# Altium project LoRa Pager v2.PrjPcb
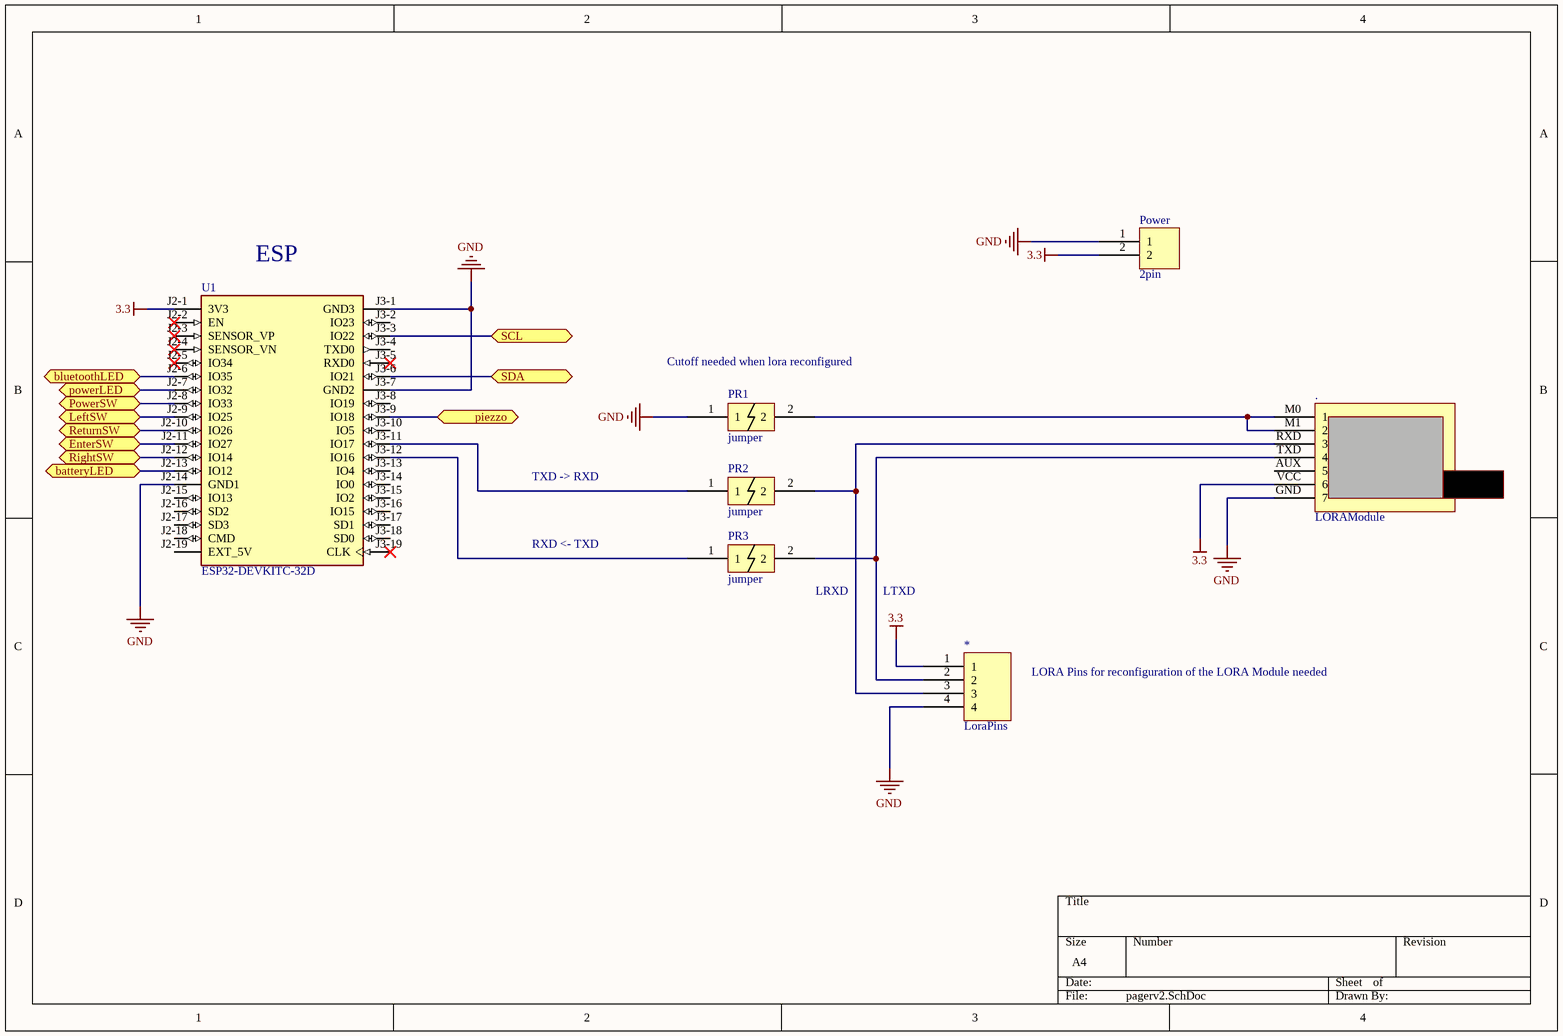
[diagram p0: pagerv2.SchDoc]
2 sheets, 26 parts. Net scope: flat (ports and power ports of the same name join across sheets).
Board file: pagerboardv2.PcbDoc
Sheets:
  pagerv2.SchDoc
  pagerv2IO.SchDoc

## Sheet pagerv2.SchDoc
size A4; SheetNumber: 1; SheetTotal: 2

### Parts
.  LORAModule  [LORAmodule]
LORA_config  LoraPins  [4pin]
Power  2pin  [2PIN]
PR1  jumper  [jumper]
PR2  jumper  [jumper]
PR3  jumper  [jumper]
U1  ESP32-DEVKITC-32D  [MODULE_ESP32-DEVKITC-32D]

### Ports
batteryLED (bidir, see pagerv2IO[2C]), bluetoothLED (bidir, see pagerv2IO[2C]), EnterSW (bidir, see pagerv2IO[1D]), LeftSW (bidir, see pagerv2IO[1B]), piezzo (bidir, see pagerv2IO[4C]), powerLED (bidir, see pagerv2IO[2C]), PowerSW (bidir, see pagerv2IO[1B]), ReturnSW (bidir, see pagerv2IO[1A]), RightSW (bidir, see pagerv2IO[1C]), SCL (bidir, see pagerv2IO[3A], pagerv2IO[3B]), SDA (bidir, see pagerv2IO[3A], pagerv2IO[3B])

### Nets
3.3: ..VCC(6) LORA_config.1 Power.2 U1.J2-1(3V3)
GND: ..GND(7) LORA_config.4 Power.1 PR1.1 U1.J2-14(GND1) U1.J3-1(GND3) U1.J3-7(GND2)
Net._M0: ..M0(1) ..M1(2) PR1.2
Net._RXD: ..RXD(3) LORA_config.3 PR2.2
Net._TXD: ..TXD(4) LORA_config.2 PR3.2
NetBuzzer_1: U1.J3-9(IO18) ; port piezzo
NetEnter_4: U1.J2-11(IO27) ; port EnterSW
NetI2C_1: U1.J3-3(IO22) ; port SCL
NetI2C_2: U1.J3-6(IO21) ; port SDA
NetLeft_4: U1.J2-9(IO25) ; port LeftSW
NetPR2_1: PR2.1 U1.J3-11(IO17)
NetPR3_1: PR3.1 U1.J3-12(IO16)
NetR1_1: U1.J2-7(IO32) ; port powerLED
NetR2_1: U1.J2-6(IO35) ; port bluetoothLED
NetR3_1: U1.J2-13(IO12) ; port batteryLED
NetReturn_4: U1.J2-10(IO26) ; port ReturnSW
NetRight_4: U1.J2-12(IO14) ; port RightSW
NetSWPOWER_4: U1.J2-8(IO33) ; port PowerSW

Not connected (* = marked no-connect by the designer): . AUX(5); U1 J2-2(EN)* J2-3(SENSOR_VP)* J2-4(SENSOR_VN)* J2-5(IO34)* J2-15(IO13) J2-16(SD2) J2-17(SD3) J2-18(CMD) J2-19(EXT_5V) J3-2(IO23) J3-4(TXD0) J3-5(RXD0)* J3-8(IO19) J3-10(IO5) J3-13(IO4) J3-14(IO0) J3-15(IO2) J3-16(IO15) J3-17(SD1) J3-18(SD0) J3-19(CLK)*

### Notes on the sheet
- (near U1) ESP
- (near PR1) Cutoff needed when lora reconfigured
- TXD -> RXD
- RXD <- TXD
- (near PR3) LRXD
- LTXD
- LORA Pins for reconfiguration of the LORA Module needed

### Library data of the parts
U1 = CMP-015-000000-1: WiFi Development Tools (802.11) ESP32 General Development Kit, ESP32-WROOM-32D on the board; MF: Espressif Systems; Price: None; Availability: In Stock; SnapEDA_Link: https://www.snapeda.com/parts/ESP32-DEVKITC-32D/Espressif+Systems/view-part/?ref=snap; Value: *; Purchase-URL: https://pricing.snapeda.com/search/part/ESP32-DEVKITC-32D/?ref=eda; Pin Count: 38; Check_prices: https://www.snapeda.com/parts/ESP32-DEVKITC-32D/Espressif+Systems/view-part/?ref=eda; Package: None; MP: ESP32-DEVKITC-32D; Component Type: Standard; Design Item ID: ESP32-DEVKITC-32D; Source: ESP32-DEVKITC-32D.SchLib

## Sheet pagerv2IO.SchDoc
size A4; SheetNumber: 2; SheetTotal: 2
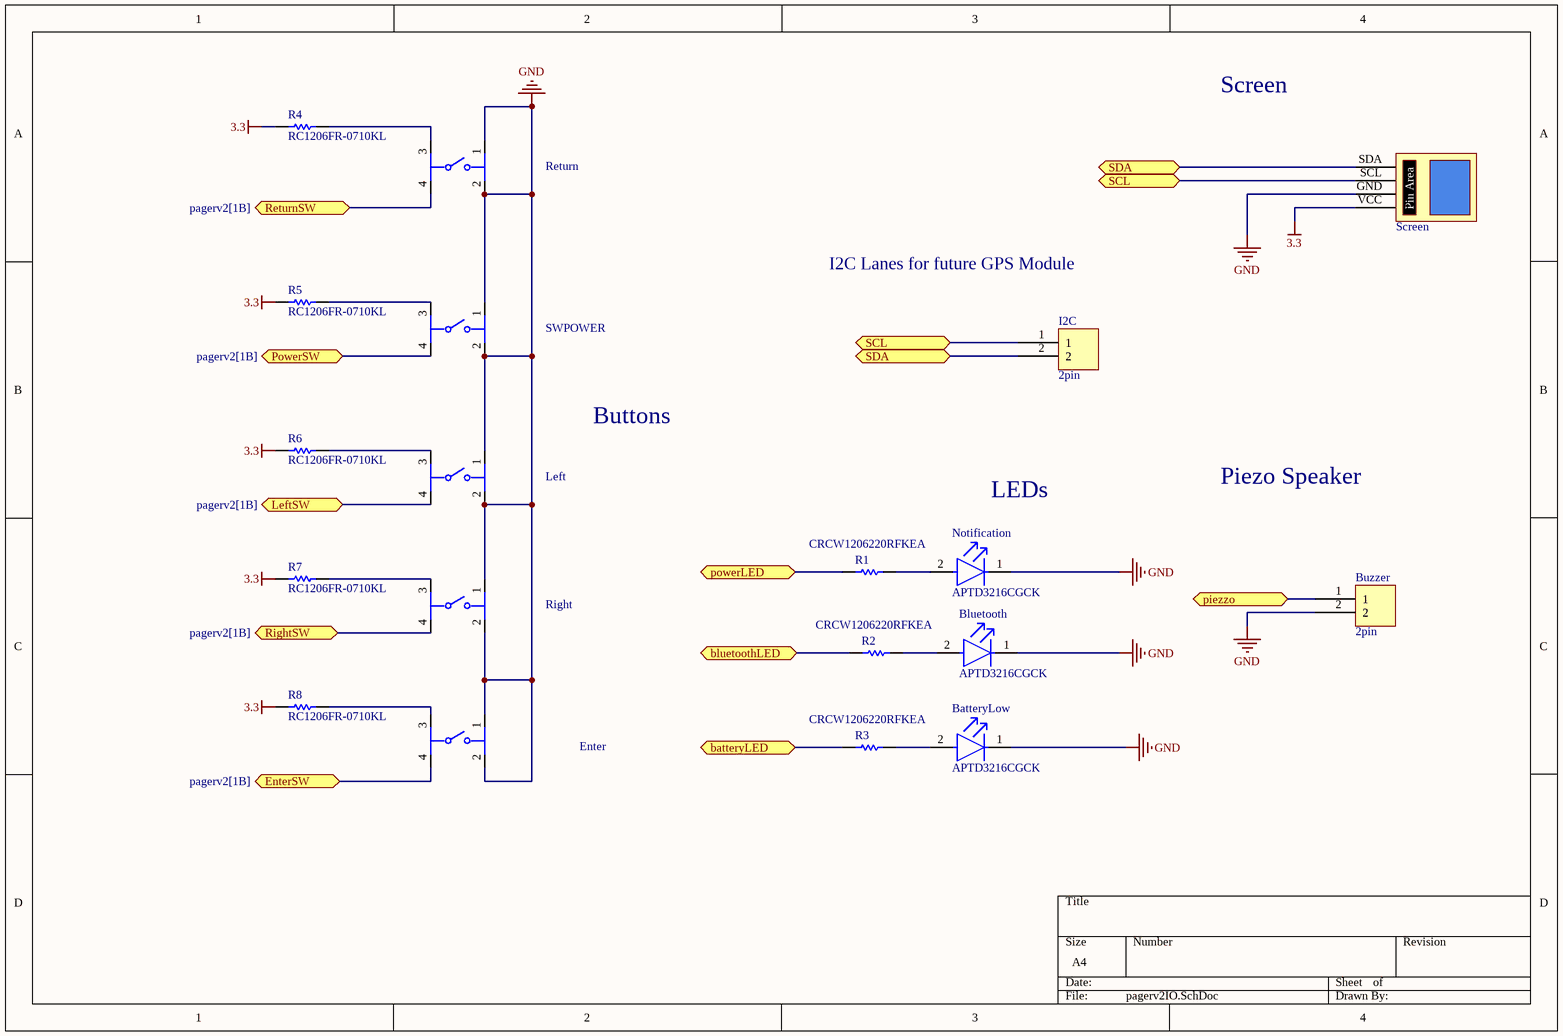
[diagram p1: pagerv2IO.SchDoc]

### Parts
BatteryLow  APTD3216CGCK  [FP-APTD3216CGCK-MFG]
Bluetooth  APTD3216CGCK  [FP-APTD3216CGCK-MFG]
Buzzer  2pin  [2PIN]
Enter  PTS645SH50SMTR92LFS  [FP-PTS645SH50SMTR92LFS-MFG]  (value not drawn)
I2C  2pin  [2PIN]
Left  PTS645SH50SMTR92LFS  [FP-PTS645SH50SMTR92LFS-MFG]  (value not drawn)
Notification  APTD3216CGCK  [FP-APTD3216CGCK-MFG]
R1  CRCW1206220RFKEA  [RESC3216X60X45ML10T20]
R2  CRCW1206220RFKEA  [RESC3216X60X45ML10T20]
R3  CRCW1206220RFKEA  [RESC3216X60X45ML10T20]
R4  RC1206FR-0710KL  [RESC3116X65X40ML10T20]
R5  RC1206FR-0710KL  [RESC3116X65X40ML10T20]
R6  RC1206FR-0710KL  [RESC3116X65X40ML10T20]
R7  RC1206FR-0710KL  [RESC3116X65X40ML10T20]
R8  RC1206FR-0710KL  [RESC3116X65X40ML10T20]
Return  PTS645SH50SMTR92LFS  [FP-PTS645SH50SMTR92LFS-MFG]  (value not drawn)
Right  PTS645SH50SMTR92LFS  [FP-PTS645SH50SMTR92LFS-MFG]  (value not drawn)
SWPOWER  PTS645SH50SMTR92LFS  [FP-PTS645SH50SMTR92LFS-MFG]  (value not drawn)
  Screen  [Screen]

### Ports
batteryLED (bidir, see pagerv2[1B]), bluetoothLED (bidir, see pagerv2[1B]), EnterSW (bidir, see pagerv2[1B]), LeftSW (bidir, see pagerv2[1B]), piezzo (bidir, see pagerv2[2B]), powerLED (bidir, see pagerv2[1B]), PowerSW (bidir, see pagerv2[1B]), ReturnSW (bidir, see pagerv2[1B]), RightSW (bidir, see pagerv2[1B]), SCL (bidir, see pagerv2[2B], pagerv2IO[3A]), SCL (bidir, see pagerv2[2B], pagerv2IO[3B]), SDA (bidir, see pagerv2[2B], pagerv2IO[3A]), SDA (bidir, see pagerv2[2B], pagerv2IO[3B])

### Nets
3.3: R4.1 R5.1 R6.1 R7.1 R8.1 .VCC(4)
GND: BatteryLow.1(C) Bluetooth.1(C) Buzzer.2 Enter.1 Enter.2 Left.1 Left.2 Notification.1(C) Return.1 Return.2 Right.1 Right.2 SWPOWER.1 SWPOWER.2 .GND(3)
NetBatteryLow_2: BatteryLow.2(A) R3.2
NetBluetooth_2: Bluetooth.2(A) R2.2
NetBuzzer_1: Buzzer.1 ; port piezzo
NetEnter_3: Enter.3 R8.2
NetEnter_4: Enter.4 ; port EnterSW
NetI2C_1: I2C.1 .SCL(2) ; port SCL
NetI2C_2: I2C.2 .SDA(1) ; port SDA
NetLeft_3: Left.3 R6.2
NetLeft_4: Left.4 ; port LeftSW
NetNotification_2: Notification.2(A) R1.2
NetR1_1: R1.1 ; port powerLED
NetR2_1: R2.1 ; port bluetoothLED
NetR3_1: R3.1 ; port batteryLED
NetR4_2: R4.2 Return.3
NetR5_2: R5.2 SWPOWER.3
NetR7_2: R7.2 Right.3
NetReturn_4: Return.4 ; port ReturnSW
NetRight_4: Right.4 ; port RightSW
NetSWPOWER_4: SWPOWER.4 ; port PowerSW

### Notes on the sheet
- Screen
- I2C Lanes for future GPS Module
- Buttons
- LEDs
- Piezo Speaker
- (in symbol Screen) Pin Area

### Library data of the parts
BatteryLow Bluetooth Notification = CMP-2000-05792-2: LED GREEN CLEAR 2SMD; Forward Voltage: 2.1V; Forward Current: 20mA; Luminous Intensity: 300mcd; Number of LEDs: 1; Dominant Wavelength: 570nm; Viewing Angle: 50°; Lead Free: Lead Free; Lens Color: Clear; Mount: Surface Mount; Package Quantity: 2000; Height: 1.8mm; Number of Pins: 2; Test Current: 20mA; Case Code (Metric): 3216; Case/Package: 1206; Case Code (Imperial): 1206; Illumination Color: Green; Color: Green; Width: 1.6mm; Packaging: Tape and Reel; Min Operating Temperature: -40°C; Lens Style: Clear; Max Operating Temperature: 85°C; Length: 3.2mm
Enter Left Return Right SWPOWER = CMP-10040-000028-1: SWITCH TACTILE SPST-NO 0.05A 12V; Operating Force: 200gf; Current Rating: 50mA; Illumination Type: Non-Illuminated; Actuator Material: Nylon; Throw Configuration: SPST; Switch Function: Off-Mom; Mechanical Life: 100000Cycles; Actuator Type: Standard; Packaging: Tape and Reel; Termination: Gull Wing; Max Operating Temperature: 60°C; Length: 6mm; REACH SVHC: No SVHC; Orientation: Straight; Max Voltage Rating (DC): 12V; Package Quantity: 1000; Max Current Rating: 50mA; Mount: Surface Mount; Contact Material: Bronze; Case/Package: SMD/SMT; Lead Free: Lead Free; Min Operating Temperature: -20°C; Contact Plating: Silver; Color: Black; Depth: 9mm; Voltage Rating (DC): 12V
R1-R3 = CMP-2003-01956-1: Manufacturer: Vishay Dale; Part Number: CRCW1206220RFKEA
R4-R8 = CMP-1014-00623-2: Chip Resistor, 10 KOhm, +/- 1%, 0.25 W, -55 to 155 degC, 1206 (3216 Metric), RoHS, Tape and Reel; Manufacturer: Yageo; Voltage Rating: 200V; Resistance: 10KOhm; Temperature Coefficient: 100ppm/degreesC; Power Rating: 250mW; Packaging: TapeandReel; Termination: SMD/SMT; REACH SVHC: Unknown; Tolerance: 1%; Height: 0.55mm; Composition: ThickFilm; Max Operating Temperature: 155degC; Datasheet Version: Rev. 5, 10/2016; Lead Free: LeadFree; Case Code (Metric): 3216; Depth: 1.6mm; Package Quantity: 5000; RoHSCompliant: true; Military Standard: Not; Case/Package: 1206; Case Code (Imperial): 1206; Min Operating Temperature: -55degC; Datasheet URL: http://www.yageo.com/NewPortal/yageodocoutput?fileName=/pdf/R-Chip/PYu-RC_Group_51_RoHS_L_5.pdf; Length: 3.1mm; Manufacturer URL: http://www.yageo.com/; Package Reference: 1206.0; Width: 1.6mm; Package Description: 2-Pin Surface Mount Device, Body 3.1 x 1.6 mm

## Nets that join several sheets
3.3: pagerv2 (..VCC LORA_config.1 Power.2 U1.J2-1), pagerv2IO (6 pins)
GND: pagerv2 (7 pins), pagerv2IO (15 pins)
NetBuzzer_1: pagerv2 (U1.J3-9), pagerv2IO (Buzzer.1)
NetEnter_4: pagerv2 (U1.J2-11), pagerv2IO (Enter.4)
NetI2C_1: pagerv2 (U1.J3-3), pagerv2IO (I2C.1 .SCL)
NetI2C_2: pagerv2 (U1.J3-6), pagerv2IO (I2C.2 .SDA)
NetLeft_4: pagerv2 (U1.J2-9), pagerv2IO (Left.4)
NetR1_1: pagerv2 (U1.J2-7), pagerv2IO (R1.1)
NetR2_1: pagerv2 (U1.J2-6), pagerv2IO (R2.1)
NetR3_1: pagerv2 (U1.J2-13), pagerv2IO (R3.1)
NetReturn_4: pagerv2 (U1.J2-10), pagerv2IO (Return.4)
NetRight_4: pagerv2 (U1.J2-12), pagerv2IO (Right.4)
NetSWPOWER_4: pagerv2 (U1.J2-8), pagerv2IO (SWPOWER.4)